# Altium project PCB_Project.PrjPcb
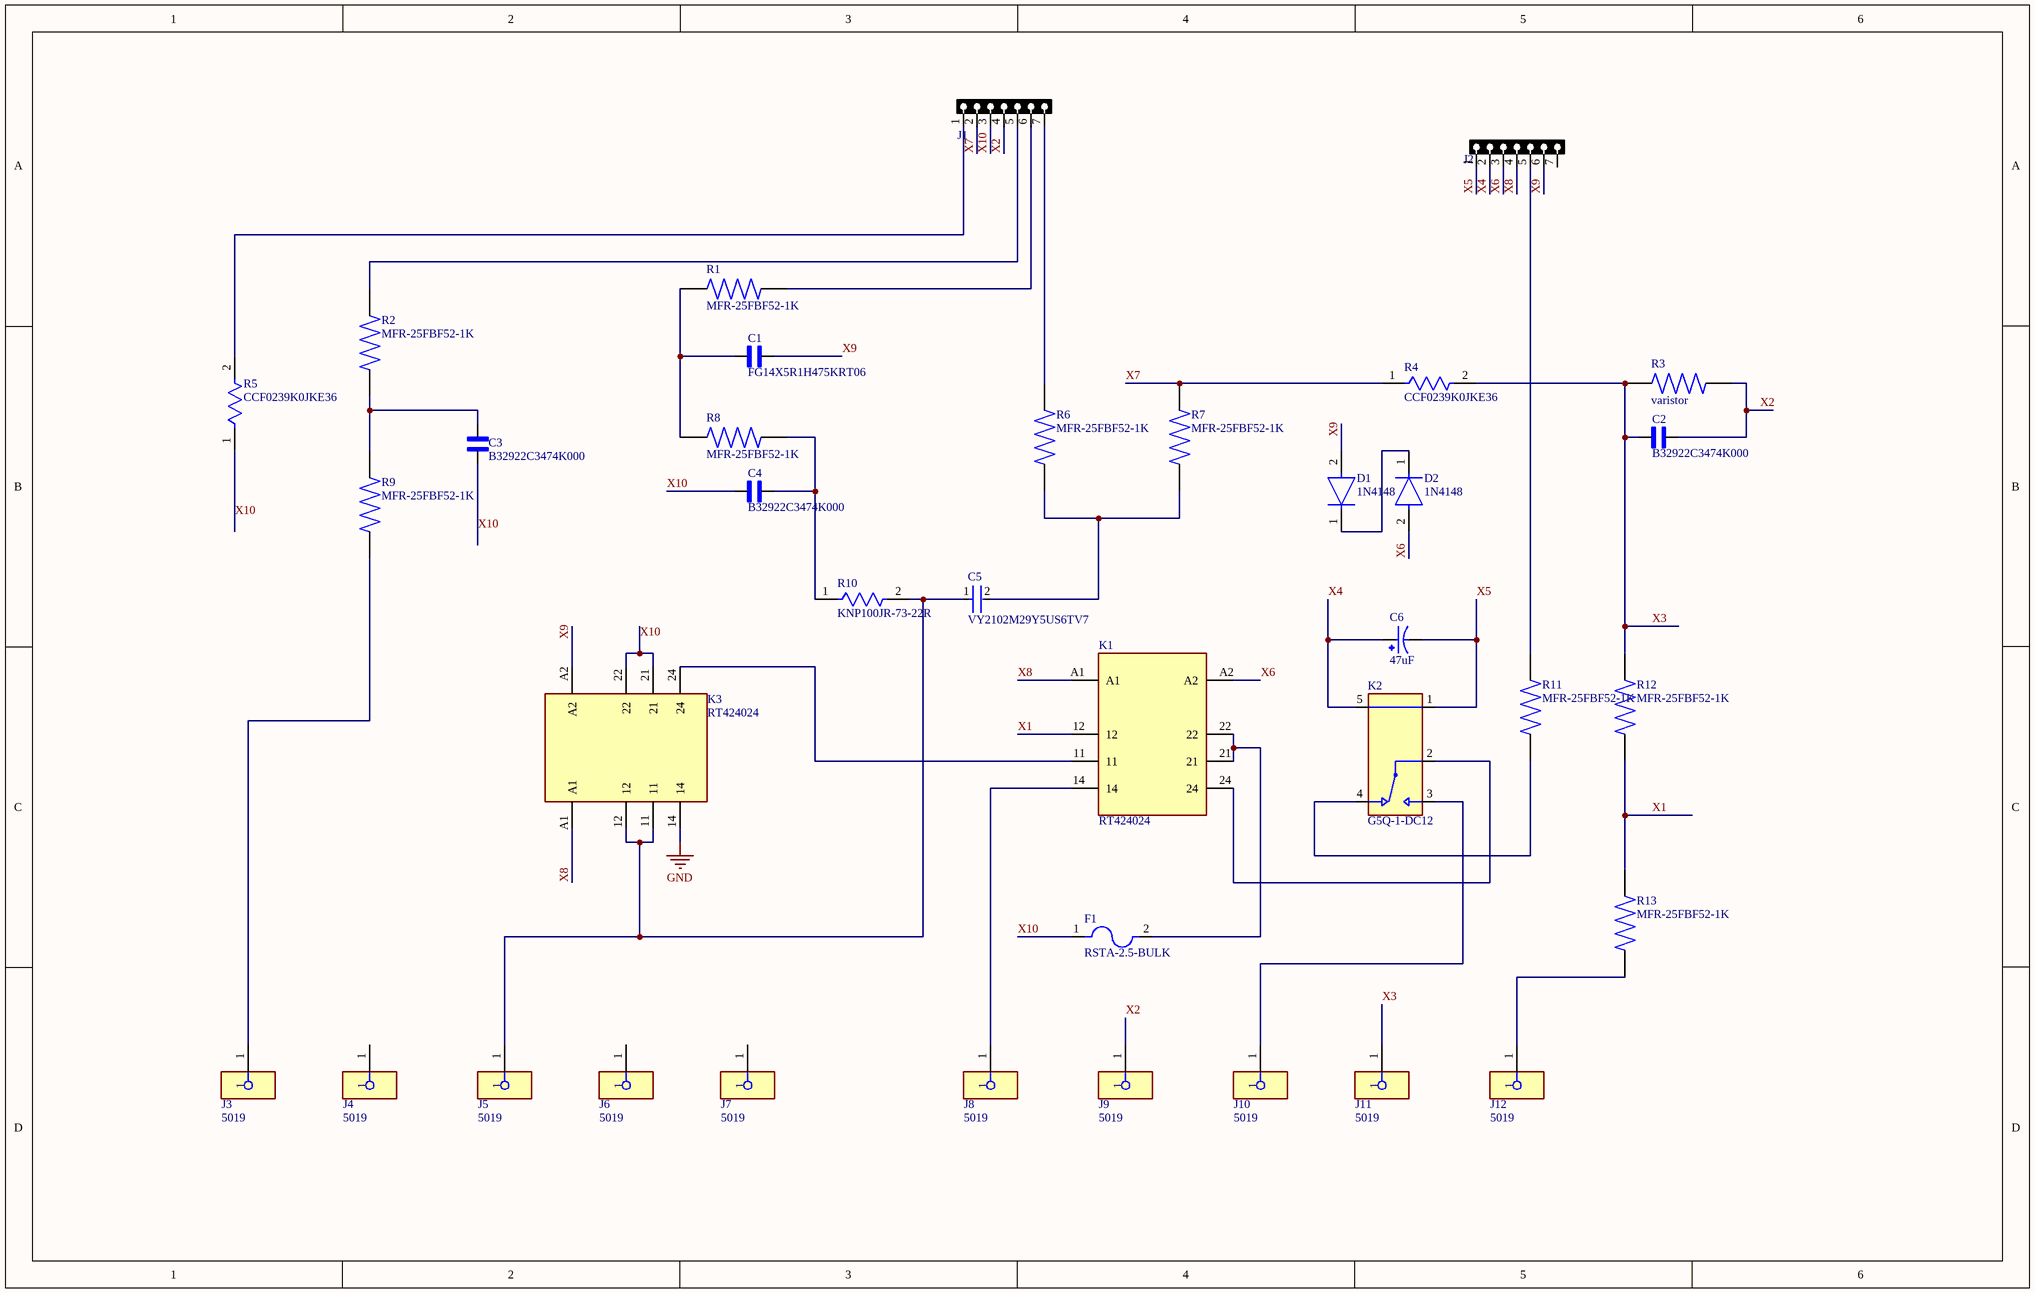
[diagram p0: Sheet1.SchDoc]
1 sheet, 37 parts. Net scope: global (net labels, ports and power ports of the same name join across sheets).

## Sheet Sheet1.SchDoc
size 381 x 241 mm; SheetNumber: 1; SheetTotal: 1

### Parts
C1  FG14X5R1H475KRT06  [CAPRB250W50L450T300H550]
C2  B32922C3474K000  [CAPRR1500W80L1800T900H1750]
C3  B32922C3474K000  [CAPRR1500W80L1800T900H1750]
C4  B32922C3474K000  [CAPRR1500W80L1800T900H1750]
C5  VY2102M29Y5US6TV7  [FP-VY2102M29Y5US6TV7-MFG]
C6  47uF  [CAPPRD500W50D630H1120]
D1  1N4148  [FP-017AG-MFG]
D2  1N4148  [FP-017AG-MFG]
F1  RSTA-2.5-BULK  [FUSE_RST-1-BULK]
J1  HDR1X7  [HDRMINI_F_1X7]  (value not drawn)
J2  HDR1X7  [HDRMINI_F_1X7]  (value not drawn)
J3  5019  [FP-5019-MFG]
J4  5019  [FP-5019-MFG]
J5  5019  [FP-5019-MFG]
J6  5019  [FP-5019-MFG]
J7  5019  [FP-5019-MFG]
J8  5019  [FP-5019-MFG]
J9  5019  [FP-5019-MFG]
J10  5019  [FP-5019-MFG]
J11  5019  [FP-5019-MFG]
J12  5019  [FP-5019-MFG]
K1  RT424024  [RELAY_RT424024]
K2  G5Q-1-DC12  [RELAY_G5Q-1-DC12]
K3  RT424024  [RELAY_RT424024]
R1  MFR-25FBF52-1K  [RESAD1100W55L680D260]
R2  MFR-25FBF52-1K  [RESAD1100W55L680D260]
R3  varistor  [RESAD1100W55L680D260]
R4  CCF0239K0JKE36  [FP-CCF02-MFG]
R5  CCF0239K0JKE36  [FP-CCF02-MFG]
R6  MFR-25FBF52-1K  [RESAD1100W55L680D260]
R7  MFR-25FBF52-1K  [RESAD1100W55L680D260]
R8  MFR-25FBF52-1K  [RESAD1100W55L680D260]
R9  MFR-25FBF52-1K  [RESAD1100W55L680D260]
R10  KNP100JR-73-22R  [FP-KNP100-MFG]
R11  MFR-25FBF52-1K  [RESAD1100W55L680D260]
R12  MFR-25FBF52-1K  [RESAD1100W55L680D260]
R13  MFR-25FBF52-1K  [RESAD1100W55L680D260]

### Nets
GND: K3.14
X1: K1.12 R12.1 R13.2
X2: C2.2 J1.4 J9.1 R3.1
X3: C2.1 J11.1 R3.2 R4.2 R12.2
X4: C6.P J2.2 K2.5
X5: C6.N J2.1 K2.1
X6: D2.2(A) J2.3 K1.A2
X7: J1.2 R4.1 R7.2
X8: J2.4 K1.A1 K3.A1
X9: C1.2 D1.2(A) J2.6 K3.A2
X10: C3.1 C4.1 F1.1 J1.3 K3.21 K3.22 R5.1
NetC1_1: C1.1 R1.2 R8.2
NetC3_2: C3.2 R2.1 R9.2
NetC4_2: C4.2 R8.1 R10.1
NetC5_1: C5.1 J5.1 K3.11 K3.12 R10.2
NetC5_2: C5.2 R6.1 R7.1
NetD1_1: D1.1(C) D2.1(C)
NetF1_2: F1.2 K1.21 K1.22
NetJ1_1: J1.1 R5.2
NetJ1_5: J1.5 R2.2
NetJ1_6: J1.6 R1.1
NetJ1_7: J1.7 R6.2
NetJ2_5: J2.5 R11.2
NetJ3_1: J3.1 R9.1
NetJ8_1: J8.1 K1.14
NetJ10_1: J10.1 K2.3
NetJ12_1: J12.1 R13.1
NetK1_11: K1.11 K3.24
NetK1_24: K1.24 K2.2
NetK2_4: K2.4 R11.1

Not connected (* = marked no-connect by the designer): J2 7; J4 1; J6 1; J7 1

### Library data of the parts
C1 = FG14X5R1H475KRT06: 4.7 ÂµF Â±10% 50V Ceramic Capacitor X5R Radial; MF: TDK; SnapEDA_Link: https://www.snapeda.com/parts/FG14X5R1H475KRT06/TDK/view-part/?ref=snap; Package: NON STANDARD-2 TDK; Value: *; MP: FG14X5R1H475KRT06; Check_prices: https://www.snapeda.com/parts/FG14X5R1H475KRT06/TDK/view-part/?ref=eda
C2-C4 = B32922C3474K000: Safety Capacitor, 0.47 uF, 305 VAC, Â± 10%, X2, Metallized PP, Radial Box - 2 Pin, Through Hole; MF: TDK; SnapEDA_Link: https://www.snapeda.com/parts/B32922C3474K000/TDK/view-part/?ref=snap; Package: None; Value: *; MP: B32922C3474K000; Check_prices: https://www.snapeda.com/parts/B32922C3474K000/TDK/view-part/?ref=eda
C5 = CMP-00030-42817980-1: VY2102M29Y5US6TV7 Cap Ceramic Suppression X1/Y2 0.001uF 440VAC/300VAC Y5U 20% (7.5 X 5mm) Radial 7.5mm 125C T/R; Capacitance: 1nF; Lead/Base Style: Kinked; Lead Diameter: 600µm; Voltage: 300V; Voltage Rating: 1kV; Case/Package: Radial; Height: 10.5mm; REACH SVHC: Unknown; Packaging: Tape & Reel (TR); Lead Free: Lead Free; RoHS: Compliant; Min Operating Temperature: -40°C; Max Operating Temperature: 125°C; Termination: Radial; Composition: Ceramic; Depth: 5mm; Dielectric: Y5U; Diameter: 7.5mm; Lead Pitch: 7.5mm; Schedule B: 8532230060, 8532230060; Radiation Hardening: No; Tolerance: 20%; Height - Seated (Max): 11.5062mm; Voltage Rating (AC): 300V; Material: Ceramic; Mount: Through Hole; NexarPartId: 42817980
C6 = ECA1JHG470B: Cap Aluminum Lytic 47uF 63V 20% (6.3 X 11.2mm) Radial 5mm 120mA 1000h 105Â°C Automotive Ammo; MF: Panasonic; Value: *; Check_prices: https://www.snapeda.com/parts/ECA1JHG470B/Panasonic/view-part/?ref=eda; MP: ECA1JHG470B; Purchase-URL: https://pricing.snapeda.com/search/part/ECA1JHG470B/?ref=eda; Price: None; Availability: In Stock; Package: RADIAL-2 Panasonic; SnapEDA_Link: https://www.snapeda.com/parts/ECA1JHG470B/Panasonic/view-part/?ref=snap
D1 D2 = CMP-07163-000046-1: DIODE GEN PURP 100V 200MA DO35; Forward Voltage: 1V; Max Power Dissipation: 500mW; Max Reverse Current: 5uA; Forward Current: 300mA; Current: 4A; Reverse Recovery Time: 4ns; Element Configuration: Single; Outside Diameter: 1.85mm; Capacitance: 4pF; Polarity: Standard; Max Forward Surge Current (Ifsm): 1A; Reverse Voltage: 100V; Output Current: 200mA; Average Rectified Current: 200mA; Diameter: 1.91mm; Max Repetitive Reverse Voltage (Vrrm): 100V; Current Rating: 200mA; Case/Package: DO-35; Lead Free: Lead Free; Number of Pins: 2; Recovery Time: 4ns; Packaging: Bulk; Contact Plating: Tin; Voltage: 100V; Mount: Through Hole; Max Surge Current: 4A; Package Quantity: 2000; Width: 1.91mm; Max Reverse Voltage (DC): 100V; Length: 4.56mm; Radiation Hardening: No; Power Dissipation: 500mW; Voltage Rating (DC): 100V; Peak Non-Repetitive Surge Current: 4A; REACH SVHC: No SVHC; Height: 4.56mm; Max Operating Temperature: 175°C; Series: -; Weight: 0.01lb; Min Operating Temperature: -65°C
F1 = RSTA-2.5-BULK: 2.5 A 250 V AC 63 V DC Fuse Board Mount (Cartridge Style Excluded) Through Hole Radial, Box; MF: Bel Fuse; MP: RSTA 2.5 BULK; SnapEDA_Link: https://www.snapeda.com/parts/RSTA%202.5%20BULK/Bel+Circuit+Protection/view-part/?ref=snap; Package: Radial Box  Bel Fuse; Value: *; Check_prices: https://www.snapeda.com/parts/RSTA%202.5%20BULK/Bel+Circuit+Protection/view-part/?ref=eda
J1 J2 = HDRMINI_F_1X7: CONN, HEADER, Female, pitch: 1.27mm, 7POS; VALUE: HDRMINI_7
J3-J12 = CMP-1672-00008-2: NexarPartId: 22052288; Number of Contacts: 1; Contact Material: Bronze, Silver; Number of Pins: 1; Lead Free: Lead Free; Packaging: Tape and Reel; Mount: Surface Mount; Height: 2.286mm; Contact Plating: Silver; Material: Bronze; Termination: SMD/SMT; REACH SVHC: No SVHC; RoHS: Compliant
K1 K3 = RT424024: General Purpose Relay DPDT (2 Form C) 24VDC Coil Through Hole; MF: TE Connectivity; Package: DIP-8 Measurement Specialties; MP: RT424024; Price: None; Availability: In Stock; Purchase-URL: https://pricing.snapeda.com/search/part/RT424024/?ref=eda; Check_prices: https://www.snapeda.com/parts/RT424024/TE+Connectivity+Potter+%2526+Brumfield+Relays/view-part/?ref=eda; Value: *; SnapEDA_Link: https://www.snapeda.com/parts/RT424024/TE+Connectivity+Potter+%2526+Brumfield+Relays/view-part/?ref=snap
K2 = G5Q-1-DC12: General Purpose Relay SPDT _1 Form C_ 12VDC Coil Through Hole; MF: Omron Electronics; Availability: Unavailable; SnapEDA_Link: https://www.snapeda.com/parts/G5Q-1-DC12/Omron%20Electronics%20Inc-EMC%20Div/view-part/543447/?ref=snap; Price: None; Package: None; MP: G5Q-1-DC12; Value: *
R1-R3 R6-R9 R11-R13 = MFR-25FBF52-1K: 1.07 kOhms Â±1% 0.25W, 1/4W Through Hole Resistor Axial - Metal Film; MF: Yageo; SnapEDA_Link: https://www.snapeda.com/parts/MFR-25FBF52-1K/Yageo/view-part/?ref=snap; Package: RADIAL-2 YAGEO; Value: *; MP: MFR-25FBF52-1K; Check_prices: https://www.snapeda.com/parts/MFR-25FBF52-1K/Yageo/view-part/?ref=eda
R4 R5 = CMP-02408-000002-1: Metal Film Resistors - Through Hole; Manufacturer: Vishay; Voltage Rating: 350V; Temperature Coefficient: 100ppm/°C; Tolerance: 5%; Value: 39kΩ; Power Rating: 2W; Package: CCF02; Category: Res; Ipc Land Pattern Name: RESAD1648W105L1080D406; Height: 4.06mm; Octopart: https://octopart.com/ccf0239k0jke36-vishay-98146781; Device Class L2: Resistors; Temperature Range Low: -65°C; ComponentLink2URL: https://www.vishay.com/docs/31012/ccf02.pdf; Device Class L1: Passive Components; Device Class L3: Through-Hole Resistors; Temperature: -65°C to +230°C; Lead Free: Yes; ComponentLink2Description: Datasheet; Composition: Metal Film; Manufacturer Part Number: CCF0239K0JKE36; Series: CCF02 (CCF-2); Temperature Range High: +230°C; RoHS: TRUE; Automotive: No; Resistance: 39kΩ
R10 = CMP-03413-000004-1: RES 22 OHM 1W 5% AXIAL; Manufacturer: Yageo; Value: 22Ω; Temperature Coefficient: 300ppm/°C; Mouser Description: Wirewound Resistors 22ohm 1W 5%; ComponentLink2Description: Datasheet; Temperature: -40°C to +200°C; Series: KNP; Package: KNP100; Category: Res; ComponentLink2URL: https://www.yageo.com/upload/media/product/products/datasheet/lr/Yageo_LR_KNP_1.pdf; Automotive: No; RoHS: TRUE; Composition: Wirewound; Resistance: 22Ω; Device Class L1: Passive Components; Ipc Land Pattern Name: RESAD1811W100L1250D510; Digikey Description: RES 22 OHM 1W 5% AXIAL; Device Class L2: Resistors; Octopart: https://octopart.com/knp100jr-73-22r-yageo-19031610; Height: 5.1mm; Temperature Range High: +200°C; Temperature Range Low: -40°C; Manufacturer Part Number: KNP100JR-73-22R; Tolerance: 5%; Lead Free: Yes; Power Rating: 1W; Device Class L3: Through-Hole Resistors